# Altium schematic sheet Limit Sheets.SchDoc
size A
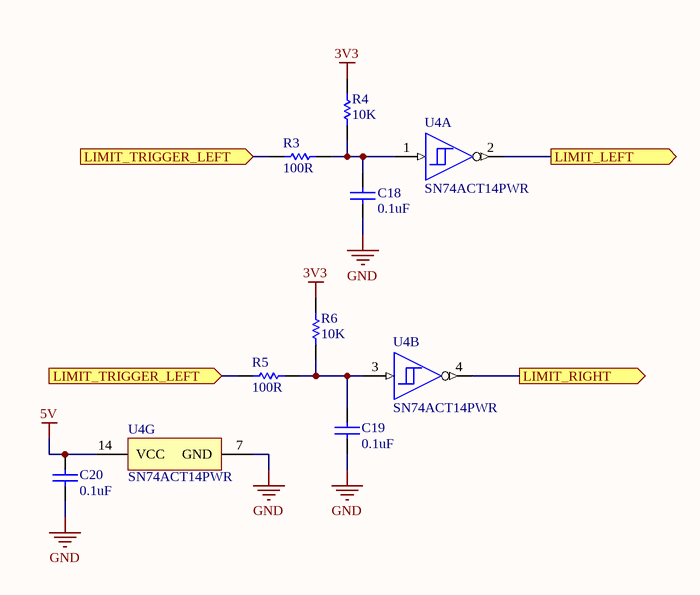
[diagram p0: Limit Sheets.SchDoc]

## Parts
C18  0.1uF  [CAPC1608X90X35LL15T15]
C19  0.1uF  [CAPC1608X90X35LL15T15]
C20  0.1uF  [CAPC1608X90X35LL15T15]
R3  100R  [RESC1609X50X30ML10T20]
R4  10K  [RESC1609X50X30ML10T20]
R5  100R  [RESC1609X50X30ML10T20]
R6  10K  [RESC1609X50X30ML10T20]
U4  SN74ACT14PWR  [PW0014A_N]  (parts A,B,G of 7)

## Ports
LIMIT_LEFT (out), LIMIT_RIGHT (out), LIMIT_TRIGGER_LEFT (in)

## Nets
3V3: R4.1 R6.1
5V: C20.2 U4.14(VCC)
GND: C18.1 C19.1 C20.1 U4.7(GND)
LIMIT_LEFT: U4.2(~{1Y}) ; port LIMIT_LEFT
LIMIT_RIGHT: U4.4(~{2Y}) ; port LIMIT_RIGHT
LIMIT_TRIGGER_LEFT: R3.1 R5.1 ; port LIMIT_TRIGGER_LEFT
NetC18_2: C18.2 R3.2 R4.2 U4.1(1A)
NetC19_2: C19.2 R5.2 R6.2 U4.3(2A)

## Library data of the parts
C18-C20 = CMP-2006-04389-2: Chip Capacitor, 100 nF, +/- 10%, 50 V, -55 to 125 degC, 0603 (1608 Metric), RoHS, Tape and Reel; Case\Package: 0603; Type (Capacitors): X7R; Capacitance: 100 nF; Voltage Rating: 50 V; Pins: 2; Max Operating Temperature: 125 degC; Min Operating Temperature: -55 degC; Case Code (Imperial): 0603; DatasheetVersion: 07/2016; Package Quantity: 4000; Length: 1.6 mm; REACH SVHC: No SVHC; Packaging: Tape and Reel; Case Code (Metric): 1608; Mounting Technology: Surface Mount; RoHSCompliant: true; Height: 0.9 mm; ComponentLink1URL: http://www.avx.com/; ComponentLink2URL: http://datasheets.avx.com/X7RDielectric.pdf; Mount: Surface Mount; ComponentLink2Description: Datasheet; Width: 0.81 mm; PackageReference: 0603; PackageDescription: 2-Pin Surface Mount Device, Body 1.6 x 0.81 mm; Radiation Hardening: No; ComponentLink1Description: Manufacturer URL; Voltage Rating (DC): 50 V; Tolerance: 10%
R3 R5 = CMP-2000-03827-1: Part Number: CRCW0603100RJNEA; Manufacturer: Vishay Dale
R4 R6 = CMP-2000-03838-1: Manufacturer: Vishay Dale; Part Number: CRCW060310K0JNEA
U4 = CMP-0268-00001-5: Hex Schmitt-Trigger Inverters, PW0014A, LARGE T&R; Manufacturer: Texas Instruments; Voltage(Nom)(V): 5; F @ Nom Voltage(Max)(Mhz): 90; Input Type: TTL; tpd @ Nom Voltage(Max)(ns): 12.5; Output Type: CMOS; Bits(#): 6; VCC(Max)(V): 5.5; Technology Family: ACT; Output Drive (IOL/IOH)(Max)(mA): -24/24; ICC @ Nom Voltage(Max)(mA): 0.02; Schmitt Trigger: Yes; VCC(Min)(V): 4.5; Rating: Catalog; Code_JEDEC: MO-153; PackageReference: PW0014A; Operating Temperature Range(C): -40 to 85; Generic Part Number: SN74ACT14; DatasheetVersion: SCAS557H